# EAGLE schematic boardV1-4 (EAGLE 6.5.0)

## Sheet 1 of 7
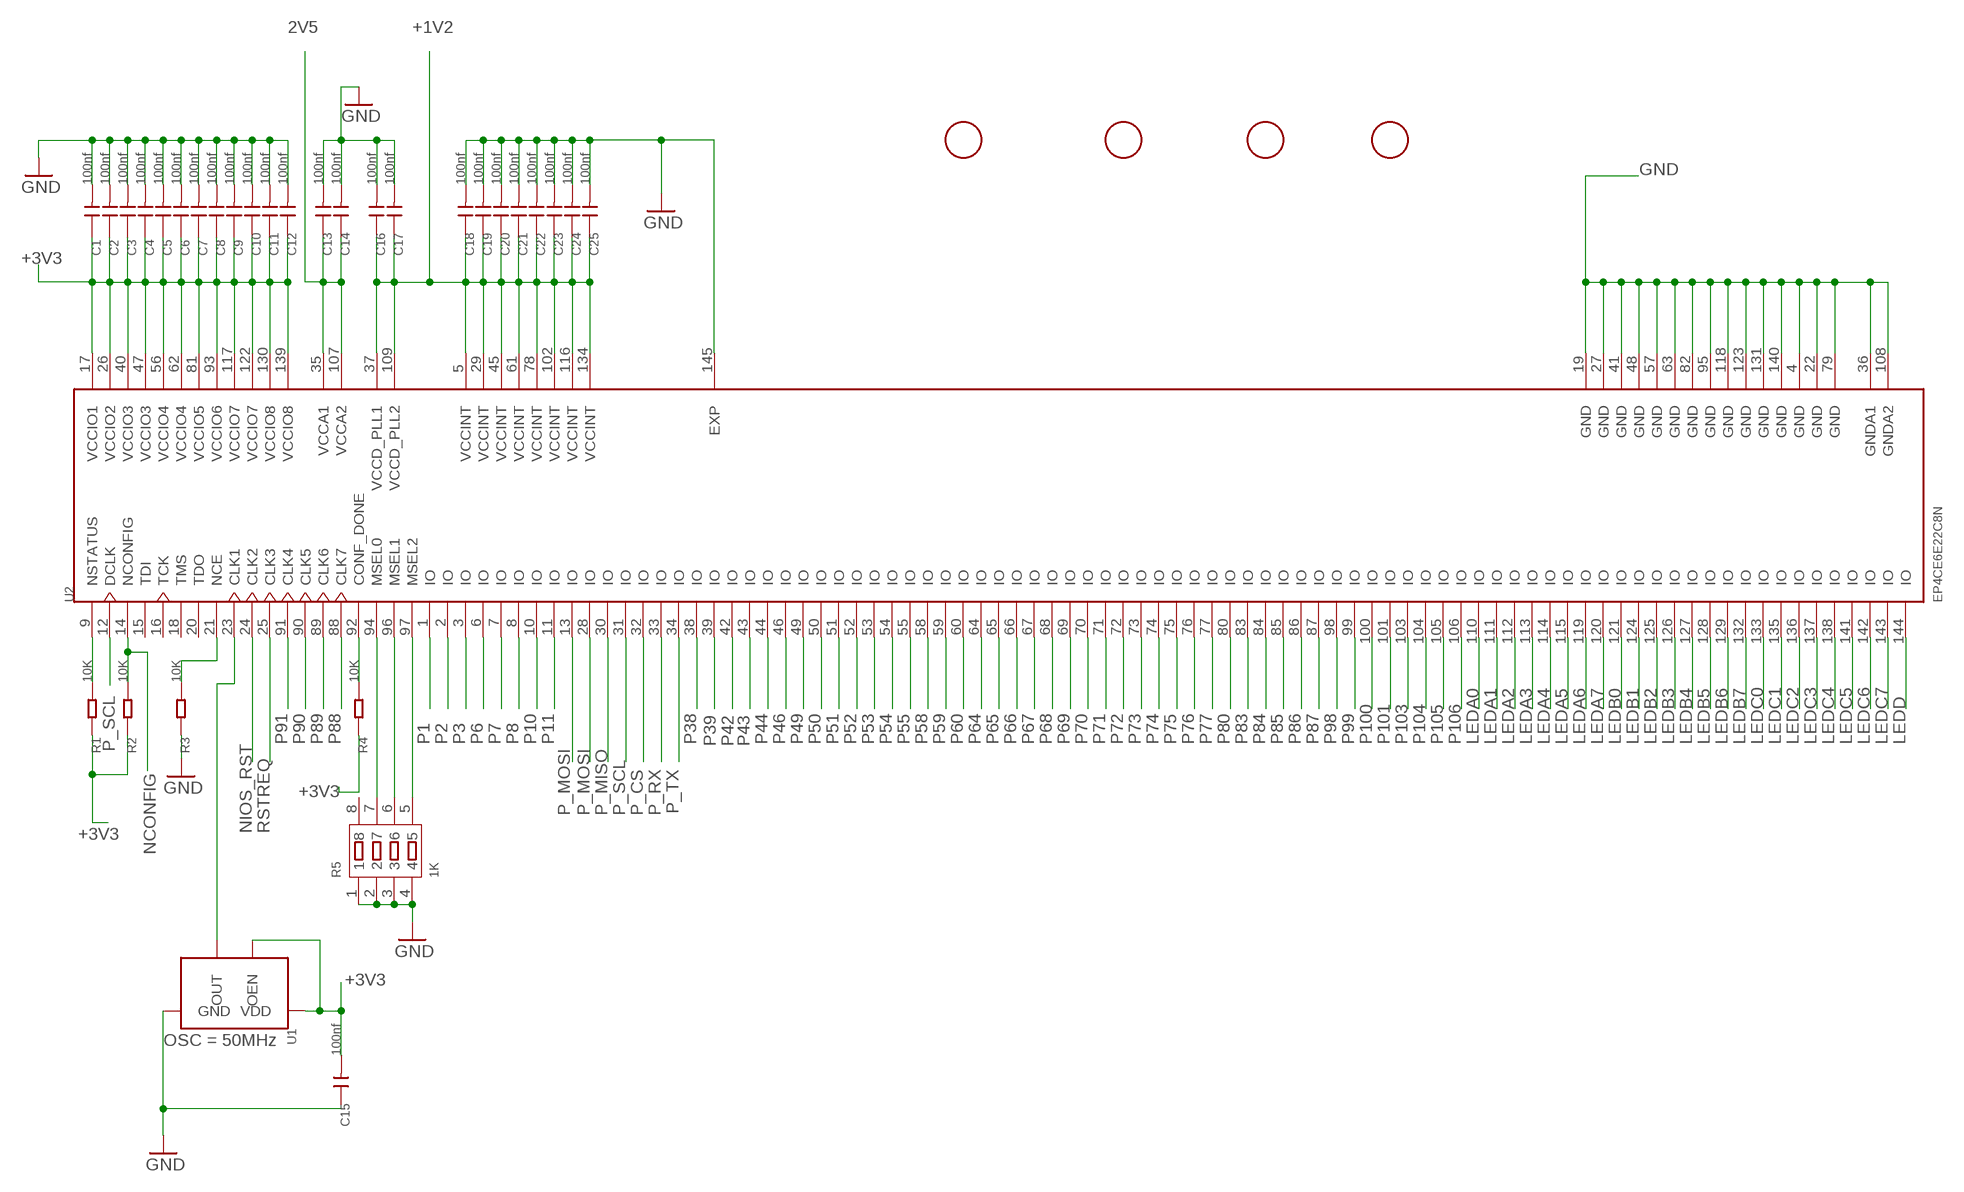
[diagram p0: schematic, sheet 1]

### Parts
C1  100nf  CERAMIC-100NF-50V-10%-X7R(0603)  [C0603]
C2  100nf  CERAMIC-100NF-50V-10%-X7R(0603)  [C0603]
C3  100nf  CERAMIC-100NF-50V-10%-X7R(0603)  [C0603]
C4  100nf  CERAMIC-100NF-50V-10%-X7R(0603)  [C0603]
C5  100nf  CERAMIC-100NF-50V-10%-X7R(0603)  [C0603]
C6  100nf  CERAMIC-100NF-50V-10%-X7R(0603)  [C0603]
C7  100nf  CERAMIC-100NF-50V-10%-X7R(0603)  [C0603]
C8  100nf  CERAMIC-100NF-50V-10%-X7R(0603)  [C0603]
C9  100nf  CERAMIC-100NF-50V-10%-X7R(0603)  [C0603]
C10  100nf  CERAMIC-100NF-50V-10%-X7R(0603)  [C0603]
C11  100nf  CERAMIC-100NF-50V-10%-X7R(0603)  [C0603]
C12  100nf  CERAMIC-100NF-50V-10%-X7R(0603)  [C0603]
C13  100nf  CERAMIC-100NF-50V-10%-X7R(0603)  [C0603]
C14  100nf  CERAMIC-100NF-50V-10%-X7R(0603)  [C0603]
C15  100nf  CERAMIC-100NF-50V-10%-X7R(0603)  [C0603]
C16  100nf  CERAMIC-100NF-50V-10%-X7R(0603)  [C0603]
C17  100nf  CERAMIC-100NF-50V-10%-X7R(0603)  [C0603]
C18  100nf  CERAMIC-100NF-50V-10%-X7R(0603)  [C0603]
C19  100nf  CERAMIC-100NF-50V-10%-X7R(0603)  [C0603]
C20  100nf  CERAMIC-100NF-50V-10%-X7R(0603)  [C0603]
C21  100nf  CERAMIC-100NF-50V-10%-X7R(0603)  [C0603]
C22  100nf  CERAMIC-100NF-50V-10%-X7R(0603)  [C0603]
C23  100nf  CERAMIC-100NF-50V-10%-X7R(0603)  [C0603]
C24  100nf  CERAMIC-100NF-50V-10%-X7R(0603)  [C0603]
C25  100nf  CERAMIC-100NF-50V-10%-X7R(0603)  [C0603]
R1  10K  SMD-RES-10K-1%-1/10W(0603)  [R0603]
R2  10K  SMD-RES-10K-1%-1/10W(0603)  [R0603]
R3  10K  SMD-RES-10K-1%-1/10W(0603)  [R0603]
R4  10K  SMD-RES-10K-1%-1/10W(0603)  [R0603]
R5  1K  SMD-RES-ARRAY-1K-4R(RA1206-8)  [RA1206-8]
U1  306020041_OSC_32.768KHZ-3225_4P  [X3225_4P]
U2  EP4CE6E22C8N  [QFP50P2200X2200X165-145N]
U$1  FIDUCIAL  [FIDUCIAL_1MM]
U$2  FIDUCIAL  [FIDUCIAL_1MM]
U$3  FIDUCIAL  [FIDUCIAL_1MM]
U$4  FIDUCIAL  [FIDUCIAL_1MM]

### Nets
2V5: C13.1 C14.1 U2.35(VCCA1) U2.107(VCCA2) ; also sheet 4
+1V2: C16.1 C17.1 C18.1 C19.1 C20.1 C21.1 C22.1 C23.1 C24.1 C25.1 U2.5(VCCINT) U2.29(VCCINT) U2.37(VCCD_PLL1) U2.45(VCCINT) U2.61(VCCINT) U2.78(VCCINT) U2.102(VCCINT) U2.109(VCCD_PLL2) U2.116(VCCINT) U2.134(VCCINT) ; also sheet 4
+3V3: C1.1 C2.1 C3.1 C4.1 C5.1 C6.1 C7.1 C8.1 C9.1 C10.1 C11.1 C12.1 C15.2 R1.1 R2.1 R4.1 U1.P$1(OEN) U1.P$4(VDD) U2.17(VCCIO1) U2.26(VCCIO2) U2.40(VCCIO3) U2.47(VCCIO3) U2.56(VCCIO4) U2.62(VCCIO4) U2.81(VCCIO5) U2.93(VCCIO6) U2.117(VCCIO7) U2.122(VCCIO7) U2.130(VCCIO8) U2.139(VCCIO8) ; also sheet 2,3,4,6,7
GND: C1.2 C2.2 C3.2 C4.2 C5.2 C6.2 C7.2 C8.2 C9.2 C10.2 C11.2 C12.2 C13.2 C14.2 C15.1 C16.2 C17.2 C18.2 C19.2 C20.2 C21.2 C22.2 C23.2 C24.2 C25.2 R3.1 R5.1 R5.2 R5.3 R5.4 U1.P$2(GND) U2.4(GND) U2.19(GND) U2.22(GND) U2.27(GND) U2.36(GNDA1) U2.41(GND) U2.48(GND) U2.57(GND) U2.63(GND) U2.79(GND) U2.82(GND) U2.95(GND) U2.108(GNDA2) U2.118(GND) U2.123(GND) U2.131(GND) U2.140(GND) U2.145(EXP) ; also sheet 2,3,4,5,6,7
LEDA0: U2.110(IO) ; also sheet 5
LEDA1: U2.111(IO) ; also sheet 5
LEDA2: U2.112(IO) ; also sheet 5
LEDA3: U2.113(IO) ; also sheet 5
LEDA4: U2.114(IO) ; also sheet 5
LEDA5: U2.115(IO) ; also sheet 5
LEDA6: U2.119(IO) ; also sheet 5
LEDA7: U2.120(IO) ; also sheet 5
LEDB0: U2.121(IO) ; also sheet 5
LEDB1: U2.124(IO) ; also sheet 5
LEDB2: U2.125(IO) ; also sheet 5
LEDB3: U2.126(IO) ; also sheet 5
LEDB4: U2.127(IO) ; also sheet 5
LEDB5: U2.128(IO) ; also sheet 5
LEDB6: U2.129(IO) ; also sheet 5
LEDB7: U2.132(IO) ; also sheet 5
LEDC0: U2.133(IO) ; also sheet 5
LEDC1: U2.135(IO) ; also sheet 5
LEDC2: U2.136(IO) ; also sheet 5
LEDC3: U2.137(IO) ; also sheet 5
LEDC4: U2.138(IO) ; also sheet 5
LEDC5: U2.141(IO) ; also sheet 5
LEDC6: U2.142(IO) ; also sheet 5
LEDC7: U2.143(IO) ; also sheet 5
LEDD: U2.144(IO) ; also sheet 5
N$1: R4.2 U2.92(CONF_DONE)
N$2: U1.P$3(OUT) U2.23(CLK1)
N$3: R5.5 U2.97(MSEL2)
N$4: R5.6 U2.96(MSEL1)
N$5: R5.7 U2.94(MSEL0)
N$6: R3.2 U2.21(NCE)
N$8: R1.2 U2.9(NSTATUS)
NCONFIG: R2.2 U2.14(NCONFIG) ; also sheet 6
NIOS_RST: U2.24(CLK2) ; also sheet 6
P1: U2.1(IO) ; also sheet 6
P2: U2.2(IO) ; also sheet 6
P3: U2.3(IO) ; also sheet 6
P6: U2.6(IO) ; also sheet 6
P7: U2.7(IO) ; also sheet 6
P8: U2.8(IO) ; also sheet 6
P10: U2.10(IO) ; also sheet 6
P11: U2.11(IO) ; also sheet 6
P38: U2.38(IO) ; also sheet 6
P39: U2.39(IO) ; also sheet 6
P42: U2.42(IO) ; also sheet 6
P43: U2.43(IO) ; also sheet 6
P44: U2.44(IO) ; also sheet 6
P46: U2.46(IO) ; also sheet 6
P49: U2.49(IO) ; also sheet 6
P50: U2.50(IO) ; also sheet 6
P51: U2.51(IO) ; also sheet 6
P52: U2.52(IO) ; also sheet 6
P53: U2.53(IO) ; also sheet 6
P54: U2.54(IO) ; also sheet 6
P55: U2.55(IO) ; also sheet 6
P58: U2.58(IO) ; also sheet 6
P59: U2.59(IO) ; also sheet 6
P60: U2.60(IO) ; also sheet 6
P64: U2.64(IO) ; also sheet 6
P65: U2.65(IO) ; also sheet 6
P66: U2.66(IO) ; also sheet 6
P67: U2.67(IO) ; also sheet 6
P68: U2.68(IO) ; also sheet 6
P69: U2.69(IO) ; also sheet 6
P70: U2.70(IO) ; also sheet 6
P71: U2.71(IO) ; also sheet 6
P72: U2.72(IO) ; also sheet 6
P73: U2.73(IO) ; also sheet 6
P74: U2.74(IO) ; also sheet 6
P75: U2.75(IO) ; also sheet 6
P76: U2.76(IO) ; also sheet 6
P77: U2.77(IO) ; also sheet 6
P80: U2.80(IO) ; also sheet 6
P83: U2.83(IO) ; also sheet 6
P84: U2.84(IO) ; also sheet 6
P85: U2.85(IO) ; also sheet 6
P86: U2.86(IO) ; also sheet 6
P87: U2.87(IO) ; also sheet 6
P88: U2.88(CLK7) ; also sheet 6
P89: U2.89(CLK6) ; also sheet 6
P90: U2.90(CLK5) ; also sheet 6
P91: U2.91(CLK4) ; also sheet 6
P98: U2.98(IO) ; also sheet 6
P99: U2.99(IO) ; also sheet 6
P100: U2.100(IO) ; also sheet 6
P101: U2.101(IO) ; also sheet 6
P103: U2.103(IO) ; also sheet 6
P104: U2.104(IO) ; also sheet 6
P105: U2.105(IO) ; also sheet 6
P106: U2.106(IO)
P_CS: U2.32(IO) ; also sheet 6
P_MISO: U2.30(IO) ; also sheet 6
P_MOSI: U2.13(IO) U2.28(IO) ; also sheet 6
P_RX: U2.33(IO) ; also sheet 6
P_SCL: U2.12(DCLK) U2.31(IO) ; also sheet 6
P_TX: U2.34(IO) ; also sheet 6
RSTREQ: U2.25(CLK3) ; also sheet 6
Unconnected: R5.8 U2.15(TDI) U2.16(TCK) U2.18(TMS) U2.20(TDO)

## Sheet 2 of 7
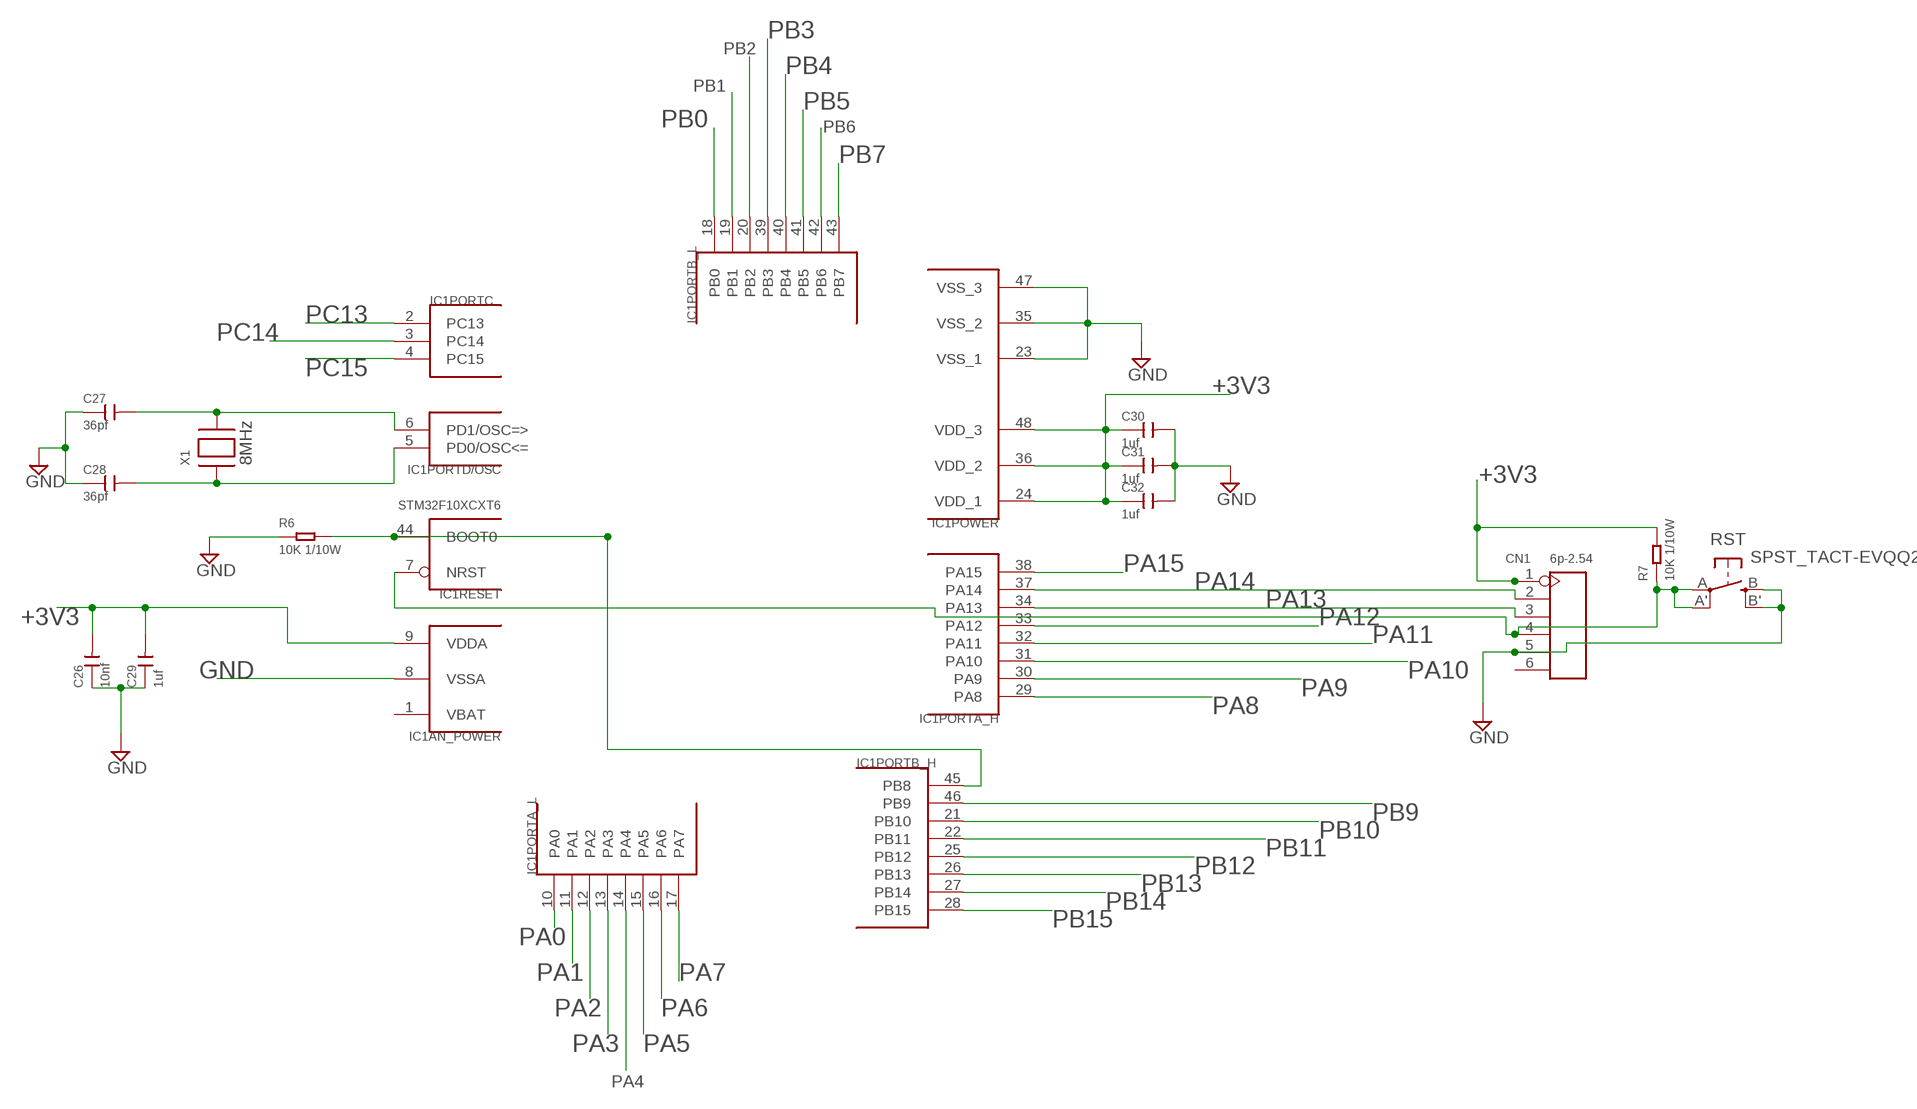
[diagram p1: schematic, sheet 2]

### Parts
C26  10nf  CERAMIC-10NF-50V-10%-X7R(0603)  [C0603]
C27  36pf  CERAMIC-12PF-50V-5%-NPO(0603)  [C0603]
C28  36pf  CERAMIC-12PF-50V-5%-NPO(0603)  [C0603]
C29  1uf  CERAMIC-1UF-25V-10%-X7R(0603)  [C0603]
C30  1uf  CERAMIC-1UF-25V-10%-X7R(0603)  [C0603]
C31  1uf  CERAMIC-1UF-25V-10%-X7R(0603)  [C0603]
C32  1uf  CERAMIC-1UF-25V-10%-X7R(0603)  [C0603]
CN1  6p-2.54  DIP-BLACK-FEMALE-HEADER-VERT(6P-2.54)  [H6-2.54]
IC1  STM32F10XCXT6  [TQFP48]
R6  10K 1/10W  SMD-RES-10K-5%-1/10W(0603)  [R0603]
R7  10K 1/10W  SMD-RES-10K-5%-1/10W(0603)  [R0603]
RST  SPST_TACT-EVQQ2  [EVQ-Q2]
X1  306010047_XTAL_12MHZ-5032_2P  [X5032_2P]

### Nets
+3V3: C26.2 C29.2 C30.1 C31.1 C32.1 CN1.1 IC1.9(AN_POWER:VDDA) IC1.24(POWER:VDD_1) IC1.36(POWER:VDD_2) IC1.48(POWER:VDD_3) R7.2 ; also sheet 1,3,4,6,7
GND: C26.1 C27.1 C28.1 C29.1 C30.2 C31.2 C32.2 CN1.5 IC1.8(AN_POWER:VSSA) IC1.23(POWER:VSS_1) IC1.35(POWER:VSS_2) IC1.47(POWER:VSS_3) R6.1 RST.B'(S1) RST.B(S) ; also sheet 1,3,4,5,6,7
N$9: IC1.44(RESET:BOOT0) IC1.45(PORTB_H:PB8) R6.2
N$10: CN1.4 IC1.7(RESET:NRST) R7.1 RST.A'(P1) RST.A(P)
N$23: C27.2 IC1.6(PORTD/OSC:PD1/OSC=>) X1.P$2
N$24: C28.2 IC1.5(PORTD/OSC:PD0/OSC<=) X1.P$1
PA0: IC1.10(PORTA_L:PA0) ; also sheet 6
PA1: IC1.11(PORTA_L:PA1) ; also sheet 6
PA2: IC1.12(PORTA_L:PA2) ; also sheet 6
PA3: IC1.13(PORTA_L:PA3) ; also sheet 6
PA4: IC1.14(PORTA_L:PA4) ; also sheet 6
PA5: IC1.15(PORTA_L:PA5) ; also sheet 6
PA6: IC1.16(PORTA_L:PA6) ; also sheet 6
PA7: IC1.17(PORTA_L:PA7) ; also sheet 6
PA8: IC1.29(PORTA_H:PA8) ; also sheet 6
PA9: IC1.30(PORTA_H:PA9) ; also sheet 6
PA10: IC1.31(PORTA_H:PA10) ; also sheet 6
PA11: IC1.32(PORTA_H:PA11) ; also sheet 3,6
PA12: IC1.33(PORTA_H:PA12) ; also sheet 3,6
PA13: CN1.3 IC1.34(PORTA_H:PA13) ; also sheet 6,7
PA14: CN1.2 IC1.37(PORTA_H:PA14) ; also sheet 6,7
PA15: IC1.38(PORTA_H:PA15) ; also sheet 6
PB0: IC1.18(PORTB_L:PB0) ; also sheet 6
PB1: IC1.19(PORTB_L:PB1) ; also sheet 5
PB2: IC1.20(PORTB_L:PB2) ; also sheet 6
PB3: IC1.39(PORTB_L:PB3) ; also sheet 6
PB4: IC1.40(PORTB_L:PB4) ; also sheet 6
PB5: IC1.41(PORTB_L:PB5) ; also sheet 6
PB6: IC1.42(PORTB_L:PB6) ; also sheet 6
PB7: IC1.43(PORTB_L:PB7) ; also sheet 6
PB9: IC1.46(PORTB_H:PB9) ; also sheet 3
PB10: IC1.21(PORTB_H:PB10) ; also sheet 6
PB11: IC1.22(PORTB_H:PB11) ; also sheet 6
PB12: IC1.25(PORTB_H:PB12) ; also sheet 6
PB13: IC1.26(PORTB_H:PB13) ; also sheet 6,7
PB14: IC1.27(PORTB_H:PB14) ; also sheet 6,7
PB15: IC1.28(PORTB_H:PB15) ; also sheet 6,7
PC13: IC1.2(PORTC:PC13) ; also sheet 6
PC14: IC1.3(PORTC:PC14) ; also sheet 6
PC15: IC1.4(PORTC:PC15) ; also sheet 6
Unconnected: CN1.6

## Sheet 3 of 7
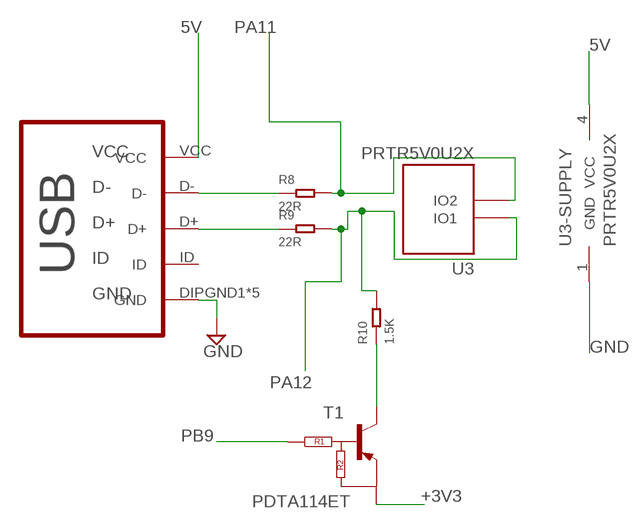
[diagram p2: schematic, sheet 3]

### Parts
R8  22R  SMD-RES-22R-5%-1/10W(0603)  [R0603]
R9  22R  SMD-RES-22R-5%-1/10W(0603)  [R0603]
R10  1.5K  SMD-RES-1.5K-1%-1/10W(0603)  [R0603]
T1  PDTA114ET  [SOT23]
U3  PRTR5V0U2X  [SOT-143B]
USB  MICRO-USB-B  [MICRO_USB_4_LEGS]

### Nets
5V: U3.4(VCC) USB.VCC ; also sheet 4
+3V3: T1.2(E) ; also sheet 1,2,4,6,7
GND: U3.1(GND) USB.DIPGND1(GND) USB.DIPGND2(GND) USB.DIPGND3(GND) USB.DIPGND4(GND) USB.GND ; also sheet 1,2,4,5,6,7
N$7: R8.1 USB.D-
N$11: R9.1 USB.D+
N$12: R10.1 T1.3(C)
PA11: R8.2 U3.3(IO2) ; also sheet 2,6
PA12: R9.2 R10.2 U3.2(IO1) ; also sheet 2,6
PB9: T1.1(INPUT) ; also sheet 2
Unconnected: USB.ID

## Sheet 4 of 7
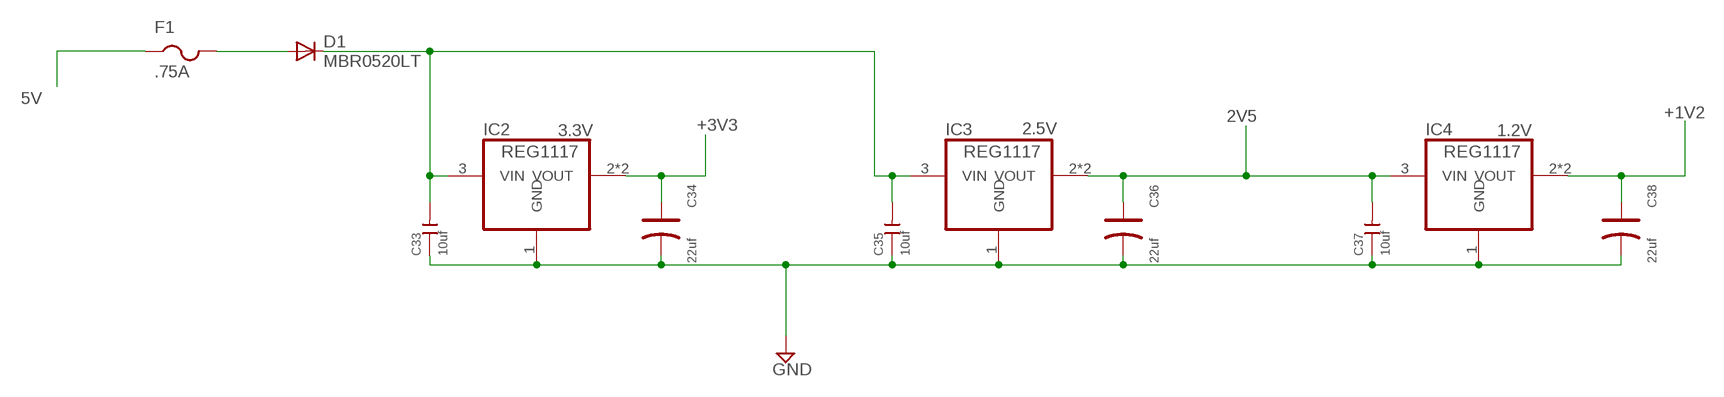
[diagram p3: schematic, sheet 4]

### Parts
C33  10uf  CERAMIC-10UF-25V-10%-X5R(0805)  [C0805]
C34  22uf  TANTALUM-SMD-22UF-6.3V(AVX-A)  [AVX-A]
C35  10uf  CERAMIC-10UF-25V-10%-X5R(0805)  [C0805]
C36  22uf  TANTALUM-SMD-22UF-6.3V(AVX-A)  [AVX-A]
C37  10uf  CERAMIC-10UF-25V-10%-X5R(0805)  [C0805]
C38  22uf  TANTALUM-SMD-22UF-6.3V(AVX-A)  [AVX-A]
D1  MBR0520LT  [SOD123]
F1  .75A  PTCFUSE-1206  [R1206]
IC2  REG1117  [SOT223]
IC3  REG1117  [SOT223]
IC4  REG1117  [SOT223]

### Nets
2V5: C36.+ C37.2 IC3.2(VOUT) IC3.4(VOUT) IC4.3(VIN) ; also sheet 1
5V: F1.1 ; also sheet 3
+1V2: C38.+ IC4.2(VOUT) IC4.4(VOUT) ; also sheet 1
+3V3: C34.+ IC2.2(VOUT) IC2.4(VOUT) ; also sheet 1,2,3,6,7
GND: C33.1 C34.- C35.1 C36.- C37.1 C38.- IC2.1(GND) IC3.1(GND) IC4.1(GND) ; also sheet 1,2,3,5,6,7
N$13: C33.2 C35.2 D1.C IC2.3(VIN) IC3.3(VIN)
N$14: D1.A F1.2

## Sheet 5 of 7
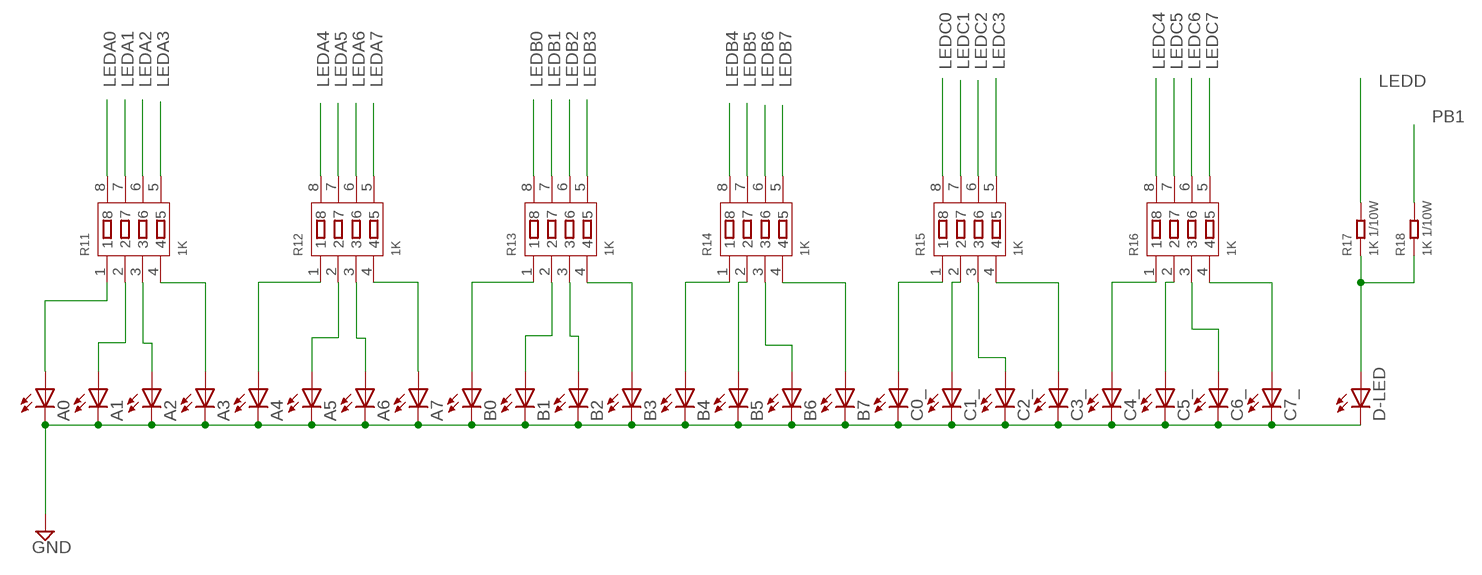
[diagram p4: schematic, sheet 5]

### Parts
A0  LEDCHIPLED_0603  [CHIPLED_0603]
A1  LEDCHIPLED_0603  [CHIPLED_0603]
A2  LEDCHIPLED_0603  [CHIPLED_0603]
A3  LEDCHIPLED_0603  [CHIPLED_0603]
A4  LEDCHIPLED_0603  [CHIPLED_0603]
A5  LEDCHIPLED_0603  [CHIPLED_0603]
A6  LEDCHIPLED_0603  [CHIPLED_0603]
A7  LEDCHIPLED_0603  [CHIPLED_0603]
B0  LEDCHIPLED_0603  [CHIPLED_0603]
B1  LEDCHIPLED_0603  [CHIPLED_0603]
B2  LEDCHIPLED_0603  [CHIPLED_0603]
B3  LEDCHIPLED_0603  [CHIPLED_0603]
B4  LEDCHIPLED_0603  [CHIPLED_0603]
B5  LEDCHIPLED_0603  [CHIPLED_0603]
B6  LEDCHIPLED_0603  [CHIPLED_0603]
B7  LEDCHIPLED_0603  [CHIPLED_0603]
C0_  LEDCHIPLED_0603  [CHIPLED_0603]
C1_  LEDCHIPLED_0603  [CHIPLED_0603]
C2_  LEDCHIPLED_0603  [CHIPLED_0603]
C3_  LEDCHIPLED_0603  [CHIPLED_0603]
C4_  LEDCHIPLED_0603  [CHIPLED_0603]
C5_  LEDCHIPLED_0603  [CHIPLED_0603]
C6_  LEDCHIPLED_0603  [CHIPLED_0603]
C7_  LEDCHIPLED_0603  [CHIPLED_0603]
D-LED  LEDCHIPLED_0603  [CHIPLED_0603]
R11  1K  SMD-RES-ARRAY-1K-4R(RA1206-8)  [RA1206-8]
R12  1K  SMD-RES-ARRAY-1K-4R(RA1206-8)  [RA1206-8]
R13  1K  SMD-RES-ARRAY-1K-4R(RA1206-8)  [RA1206-8]
R14  1K  SMD-RES-ARRAY-1K-4R(RA1206-8)  [RA1206-8]
R15  1K  SMD-RES-ARRAY-1K-4R(RA1206-8)  [RA1206-8]
R16  1K  SMD-RES-ARRAY-1K-4R(RA1206-8)  [RA1206-8]
R17  1K 1/10W  SMD-RES-1K-5%-1/10W(0603)  [R0603]
R18  1K 1/10W  SMD-RES-1K-5%-1/10W(0603)  [R0603]

### Nets
GND: A0.C A1.C A2.C A3.C A4.C A5.C A6.C A7.C B0.C B1.C B2.C B3.C B4.C B5.C B6.C B7.C C0_.C C1_.C C2_.C C3_.C C4_.C C5_.C C6_.C C7_.C D-LED.C ; also sheet 1,2,3,4,6,7
LEDA0: R11.8 ; also sheet 1
LEDA1: R11.7 ; also sheet 1
LEDA2: R11.6 ; also sheet 1
LEDA3: R11.5 ; also sheet 1
LEDA4: R12.8 ; also sheet 1
LEDA5: R12.7 ; also sheet 1
LEDA6: R12.6 ; also sheet 1
LEDA7: R12.5 ; also sheet 1
LEDB0: R13.8 ; also sheet 1
LEDB1: R13.7 ; also sheet 1
LEDB2: R13.6 ; also sheet 1
LEDB3: R13.5 ; also sheet 1
LEDB4: R14.8 ; also sheet 1
LEDB5: R14.7 ; also sheet 1
LEDB6: R14.6 ; also sheet 1
LEDB7: R14.5 ; also sheet 1
LEDC0: R15.8 ; also sheet 1
LEDC1: R15.7 ; also sheet 1
LEDC2: R15.6 ; also sheet 1
LEDC3: R15.5 ; also sheet 1
LEDC4: R16.8 ; also sheet 1
LEDC5: R16.7 ; also sheet 1
LEDC6: R16.6 ; also sheet 1
LEDC7: R16.5 ; also sheet 1
LEDD: R17.2 ; also sheet 1
N$15: A7.A R12.4
N$16: A0.A R11.1
N$17: A1.A R11.2
N$18: A2.A R11.3
N$19: A3.A R11.4
N$20: A4.A R12.1
N$21: A5.A R12.2
N$22: A6.A R12.3
N$25: B0.A R13.1
N$26: B1.A R13.2
N$27: B2.A R13.3
N$28: B3.A R13.4
N$29: B4.A R14.1
N$30: B5.A R14.2
N$31: B6.A R14.3
N$32: B7.A R14.4
N$33: C0_.A R15.1
N$34: C1_.A R15.2
N$35: C2_.A R15.3
N$36: C3_.A R15.4
N$37: C4_.A R16.1
N$38: C5_.A R16.2
N$39: C6_.A R16.3
N$40: C7_.A R16.4
N$41: D-LED.A R17.1 R18.1
PB1: R18.2 ; also sheet 2

## Sheet 6 of 7
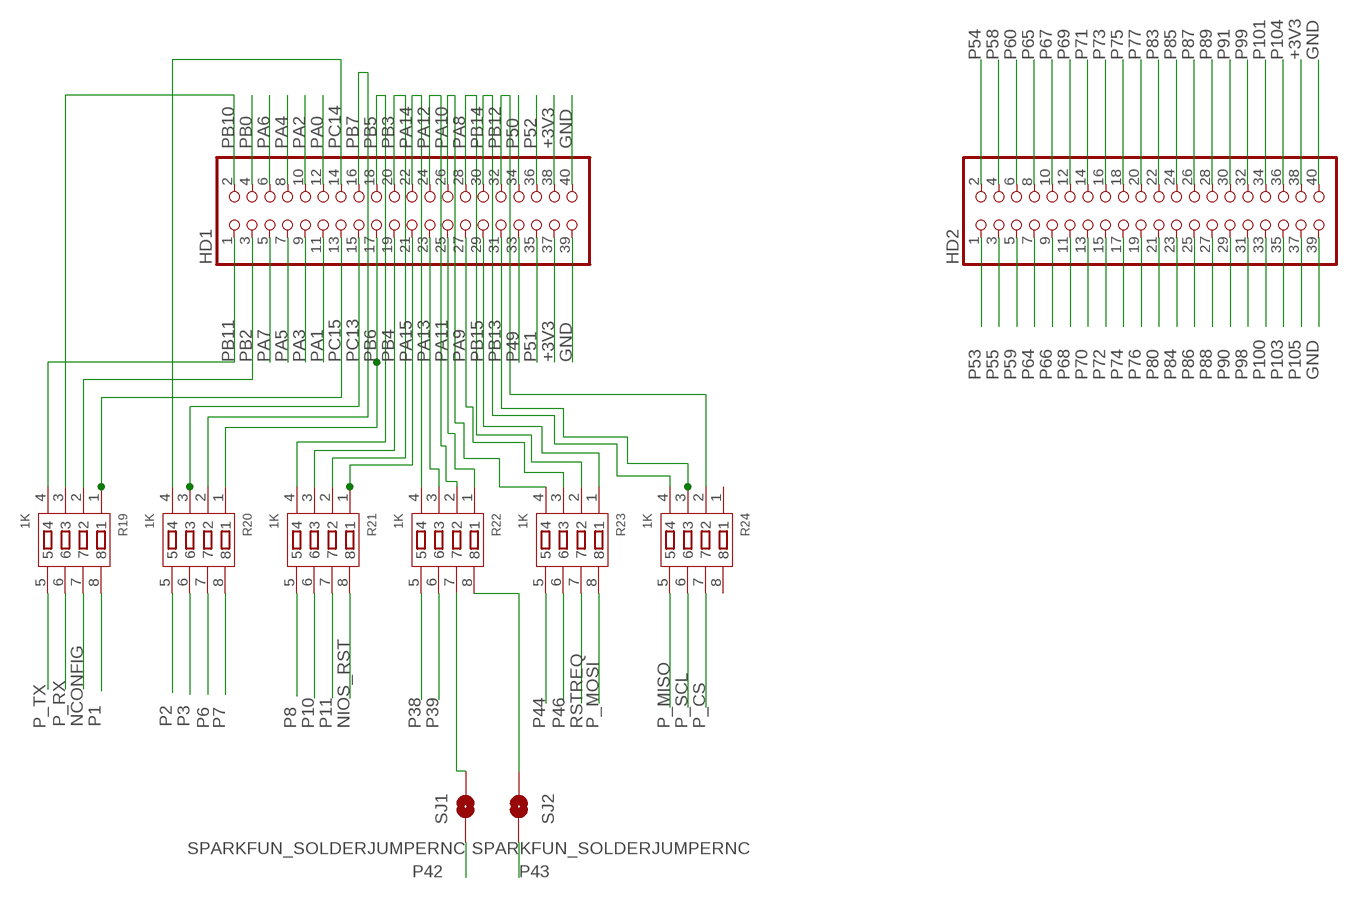
[diagram p5: schematic, sheet 6]

### Parts
HD1  PINHD-2X20  [2X20]
HD2  PINHD-2X20  [2X20]
R19  1K  SMD-RES-ARRAY-1K-4R(RA1206-8)  [RA1206-8]
R20  1K  SMD-RES-ARRAY-1K-4R(RA1206-8)  [RA1206-8]
R21  1K  SMD-RES-ARRAY-1K-4R(RA1206-8)  [RA1206-8]
R22  1K  SMD-RES-ARRAY-1K-4R(RA1206-8)  [RA1206-8]
R23  1K  SMD-RES-ARRAY-1K-4R(RA1206-8)  [RA1206-8]
R24  1K  SMD-RES-ARRAY-1K-4R(RA1206-8)  [RA1206-8]
SJ1  SPARKFUN_SOLDERJUMPERNC  [SPARKFUN_SJ_2S]
SJ2  SPARKFUN_SOLDERJUMPERNC  [SPARKFUN_SJ_2S]

### Nets
+3V3: HD1.37 HD1.38 HD2.38 ; also sheet 1,2,3,4,7
GND: HD1.39 HD1.40 HD2.39 HD2.40 ; also sheet 1,2,3,4,5,7
N$43: R22.7 SJ1.2
N$44: R22.8 SJ2.2
NCONFIG: R19.7 ; also sheet 1
NIOS_RST: R21.8 ; also sheet 1
P1: R19.8 ; also sheet 1
P2: R20.5 ; also sheet 1
P3: R20.6 ; also sheet 1
P6: R20.7 ; also sheet 1
P7: R20.8 ; also sheet 1
P8: R21.5 ; also sheet 1
P10: R21.6 ; also sheet 1
P11: R21.7 ; also sheet 1
P38: R22.5 ; also sheet 1
P39: R22.6 ; also sheet 1
P42: SJ1.1 ; also sheet 1
P43: SJ2.1 ; also sheet 1
P44: R23.5 ; also sheet 1
P46: R23.6 ; also sheet 1
P49: HD1.33 ; also sheet 1
P50: HD1.34 ; also sheet 1
P51: HD1.35 ; also sheet 1
P52: HD1.36 ; also sheet 1
P53: HD2.1 ; also sheet 1
P54: HD2.2 ; also sheet 1
P55: HD2.3 ; also sheet 1
P58: HD2.4 ; also sheet 1
P59: HD2.5 ; also sheet 1
P60: HD2.6 ; also sheet 1
P64: HD2.7 ; also sheet 1
P65: HD2.8 ; also sheet 1
P66: HD2.9 ; also sheet 1
P67: HD2.10 ; also sheet 1
P68: HD2.11 ; also sheet 1
P69: HD2.12 ; also sheet 1
P70: HD2.13 ; also sheet 1
P71: HD2.14 ; also sheet 1
P72: HD2.15 ; also sheet 1
P73: HD2.16 ; also sheet 1
P74: HD2.17 ; also sheet 1
P75: HD2.18 ; also sheet 1
P76: HD2.19 ; also sheet 1
P77: HD2.20 ; also sheet 1
P80: HD2.21 ; also sheet 1
P83: HD2.22 ; also sheet 1
P84: HD2.23 ; also sheet 1
P85: HD2.24 ; also sheet 1
P86: HD2.25 ; also sheet 1
P87: HD2.26 ; also sheet 1
P88: HD2.27 ; also sheet 1
P89: HD2.28 ; also sheet 1
P90: HD2.29 ; also sheet 1
P91: HD2.30 ; also sheet 1
P98: HD2.31 ; also sheet 1
P99: HD2.32 ; also sheet 1
P100: HD2.33 ; also sheet 1
P101: HD2.34 ; also sheet 1
P103: HD2.35 ; also sheet 1
P104: HD2.36 ; also sheet 1
P105: HD2.37 ; also sheet 1
P_CS: R24.7 ; also sheet 1
P_MISO: R24.5 ; also sheet 1
P_MOSI: R23.8 ; also sheet 1
P_RX: R19.6 ; also sheet 1
P_SCL: R24.6 ; also sheet 1
P_TX: R19.5 ; also sheet 1
PA0: HD1.12 ; also sheet 2
PA1: HD1.11 ; also sheet 2
PA2: HD1.10 ; also sheet 2
PA3: HD1.9 ; also sheet 2
PA4: HD1.8 ; also sheet 2
PA5: HD1.7 ; also sheet 2
PA6: HD1.6 ; also sheet 2
PA7: HD1.5 ; also sheet 2
PA8: HD1.28 R23.2 ; also sheet 2
PA9: HD1.27 R23.3 ; also sheet 2
PA10: HD1.26 R23.4 ; also sheet 2
PA11: HD1.25 R22.1 ; also sheet 2,3
PA12: HD1.24 R22.2 ; also sheet 2,3
PA13: HD1.23 R22.3 ; also sheet 2,7
PA14: HD1.22 R22.4 ; also sheet 2,7
PA15: HD1.21 R21.1 ; also sheet 2
PB0: HD1.4 ; also sheet 2
PB2: HD1.3 R19.2 ; also sheet 2
PB3: HD1.20 R21.2 ; also sheet 2
PB4: HD1.19 R21.3 ; also sheet 2
PB5: HD1.18 R21.4 ; also sheet 2
PB6: HD1.17 R20.1 ; also sheet 2
PB7: HD1.16 R20.2 ; also sheet 2
PB10: HD1.2 R19.3 ; also sheet 2
PB11: HD1.1 R19.4 ; also sheet 2
PB12: HD1.32 R24.2 ; also sheet 2
PB13: HD1.31 R24.3 ; also sheet 2,7
PB14: HD1.30 R24.4 ; also sheet 2,7
PB15: HD1.29 R23.1 ; also sheet 2,7
PC13: HD1.15 R20.3 ; also sheet 2
PC14: HD1.14 R20.4 ; also sheet 2
PC15: HD1.13 R19.1 ; also sheet 2
RSTREQ: R23.7 ; also sheet 1
Unconnected: R24.1 R24.8

## Sheet 7 of 7
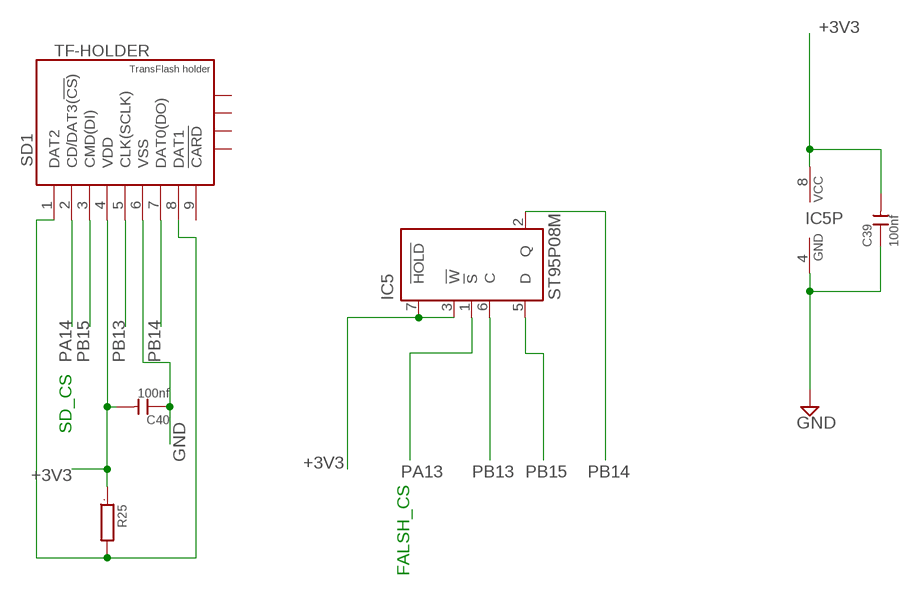
[diagram p6: schematic, sheet 7]

### Parts
C39  100nf  CERAMIC-100NF-50V-10%-X7R(0603)  [C0603]
C40  100nf  CERAMIC-100NF-50V-10%-X7R(0603)  [C0603]
IC5  ST95P08M  [SO08]
R25  R0603  [0603$1]
SD1  TF-HOLDER  [TF-PULL]

### Nets
+3V3: C39.2 C40.2 IC5.3(!W) IC5.7(!HOLD) IC5.8(VCC) R25.1 SD1.4(VDD) ; also sheet 1,2,3,4,6
GND: C39.1 C40.1 IC5.4(GND) SD1.6(VSS) ; also sheet 1,2,3,4,5,6
N$42: R25.2 SD1.1(DAT2) SD1.8(DAT1)
PA13: IC5.1(!S) ; also sheet 2,6
PA14: SD1.2(CD/DAT3(!CS!)) ; also sheet 2,6
PB13: IC5.6(C) SD1.5(CLK(SCLK)) ; also sheet 2,6
PB14: IC5.2(Q) SD1.7(DAT0(DO)) ; also sheet 2,6
PB15: IC5.5(D) SD1.3(CMD(DI)) ; also sheet 2,6
Unconnected: SD1.9(!CARD) SD1.S1 SD1.S2 SD1.S3 SD1.S4

### Notes on the sheet
- SD_CS
- FALSH_CS

## Power pins joined to a net without a drawn wire
VBAT: IC1.1(AN_POWER:VBAT)

## Library data of the parts
A0 A1-A7 B0 B1-B7 C0_ C1_ C2_ C3_ C4_ C5_ C6_ C7_ D-LED = BPC3010_Papilio_Pro:LED: LED OSRAM: - CHIPLED LG R971, LG N971, LY N971, LG Q971, LY Q971, LO R971, LY R971 LH N974, LH R974 LS Q976, LO Q976, LY Q976 LO Q996 - Hyper CHIPLED LW Q18S LB Q993, LB Q99A, LB R99A - SideLED LS A670, LO A670, LY A670, LG A670, LP A670 LB A673, LV A673, LT A673, LW A673 LH A674 LY A675 LS A676, LA A676, LO A676, LY A676, LW A676 LS A679, LY A679, LG A679 - Hyper Micro SIDELED® LS Y876, LA Y876, LO Y876, LY Y876 LT Y87S - SmartLED LW L88C, LW L88S LB L89C, LB L89S, LG L890 LS L89K, LO L89K, LY L89K LS L896, LA L896, LO L896, LY L896 - TOPLED LS T670, LO T670, LY T670, LG T670, LP T670 LSG T670, LSP T670, LSY T670, LOP T670, LYG T670 LG T671, LOG T671, LSG T671 LB T673, LV T673, LT T673, LW T673 LH T674 LS T676, LA T676, LO T676, LY T676, LB T676, LH T676, LSB T676, LW T676 LB T67C, LV T67C, LT T67C, LS T67K, LO T67K, LY T67K, LW E67C LS E67B, LA E67B, LO E67B, LY E67B, LB E67C, LV E67C, LT E67C LW T67C LS T679, LY T679, LG T679 LS T770, LO T770, LY T770, LG T770, LP T770 LB T773, LV T773, LT T773, LW T773 LH T774 LS E675, LA E675, LY E675, LS T675 LS T776, LA T776, LO T776, LY T776, LB T776 LHGB T686 LT T68C, LB T68C - Hyper Mini TOPLED® LB M676 - Mini TOPLED Santana® LG M470 LS M47K, LO M47K, LY M47K Source: http://www.osram.convergy.de LUXEON: - LUMILED® LXK2-PW12-R00, LXK2-PW12-S00, LXK2-PW14-U00, LXK2-PW14-V00 LXK2-PM12-R00, LXK2-PM12-S00, LXK2-PM14-U00 LXK2-PE12-Q00, LXK2-PE12-R00, LXK2-PE12-S00, LXK2-PE14-T00, LXK2-PE14-U00 LXK2-PB12-K00, LXK2-PB12-L00, LXK2-PB12-M00, LXK2-PB14-N00, LXK2-PB14-P00, LXK2-PB14-Q00 LXK2-PR12-L00, LXK2-PR12-M00, LXK2-PR14-Q00, LXK2-PR14-R00 LXK2-PD12-Q00, LXK2-PD12-R00, LXK2-PD12-S00 LXK2-PH12-R00, LXK2-PH12-S00 LXK2-PL12-P00, LXK2-PL12-Q00, LXK2-PL12-R00 Source: www.luxeon.com KINGBRIGHT: KA-3528ASYC Source: www.kingbright.com
C1-C25 = Seeed-OPL-Capacitor:CERAMIC-100NF-50V-10%-X7R(0603): 302010138; MPN: CC0603KRX7R9BB104
C26 = Seeed-Capacitor:CERAMIC-10NF-50V-10%-X7R(0603): 302010140; MPN: CC0603KRX7R9BB103
C27 C28 = Seeed-Capacitor:CERAMIC-12PF-50V-5%-NPO(0603): 302010067; MPN: CC0603JRNPO9BN120; VALUE: 12pf
C29-C32 = Seeed-Capacitor:CERAMIC-1UF-25V-10%-X7R(0603): 302010139; MPN: CC0603KRX7R8BB105
C33 C35 C37 = Seeed-Capacitor:CERAMIC-10UF-25V-10%-X5R(0805): 302010178; MPN: CC0805KKX5R8BB106
C34 C36 C38 = Seeed-OPL-Capacitor:TANTALUM-SMD-22UF-6.3V(AVX-A): 302020009; MPN: TAJA226K006RNJ
C39 C40 = Seeed-Capacitor:CERAMIC-100NF-50V-10%-X7R(0603): 302010138; MPN: CC0603KRX7R9BB104
CN1 = Seeed-Connector:DIP-BLACK-FEMALE-HEADER-VERT(6P-2.54): 320030060; MPN: F185-1106A1BSYC1
D1 = diode:MBR0520LT: SCHOTTKY BARRIER RECTIFIER Source: http://onsemi.com .. MBR0520LT1-D.pdf
F1 = adafruit:PTCFUSE: PTC fuses, resettable thermistors
HD1 HD2 = adafruit:PINHD-2X20: PIN HEADER
IC1 = stm32:STM32F10XCXT6: ST STM32F101/103 48pin LQFP
IC2 = burr-brown:REG1117: 800mA and 1A Low Dropout (LDO) Positive Regulator 1.8V, 2.5V, 2.85V, 3.3V, 5V, and Adj; MPN: REG1117; OC_FARNELL: 1097566; OC_NEWARK: 14P6981; OUT: 3.3V
IC3 = burr-brown:REG1117: 800mA and 1A Low Dropout (LDO) Positive Regulator 1.8V, 2.5V, 2.85V, 3.3V, 5V, and Adj; MPN: REG1117; OC_FARNELL: 1097566; OC_NEWARK: 14P6981; OUT: 2.5V
IC4 = burr-brown:REG1117: 800mA and 1A Low Dropout (LDO) Positive Regulator 1.8V, 2.5V, 2.85V, 3.3V, 5V, and Adj; MPN: REG1117; OC_FARNELL: 1097566; OC_NEWARK: 14P6981; V: 1.2V
IC5 = st-microelectronics:ST95P08M: Serial EEPROM SPI bus, 1 K x 8; OC_FARNELL: unknown; OC_NEWARK: unknown
R1-R4 = Seeed-OPL-Resistor:SMD-RES-10K-1%-1/10W(0603): 301010299; MPN: RC0603FR-0710KL
R5 R11-R16 = Seeed-OPL-Resistor:SMD-RES-ARRAY-1K-4R(RA1206-8): 301030012; MPN: Chip-Array-Series-1%
R6 R7 = Seeed-Resistor:SMD-RES-10K-5%-1/10W(0603): 301010293; MPN: RC0603JR-0710KL
R8 R9 = Seeed-OPL-Resistor:SMD-RES-22R-5%-1/10W(0603): 301010289; MPN: RC0603JR-0722RL
R10 = Seeed-Resistor:SMD-RES-1.5K-1%-1/10W(0603): 301010189; MPN: RC0603FR-071K5L
R17 R18 = Seeed-OPL-Resistor:SMD-RES-1K-5%-1/10W(0603): 301010291; MPN: RC0603JR-071KL
R19-R24 = Seeed-Resistor:SMD-RES-ARRAY-1K-4R(RA1206-8): 301030012; MPN: Chip-Array-Series-1%
R25 = BPC3010_Papilio_Pro:R: RESISTOR, European symbol
RST = adafruit:SPST_TACT: SMT 6mm switch, EVQQ2 series http://www.ladyada.net/library/eagle
SD1 = sd-mmc:TF-HOLDER: TF / Micro SD socket is PUSH-PUSH type, the card can be pushed into and auto locked and pushed out by simply press the card. Surface Mounting type.
SJ1 SJ2 = CANBusTriple_f:SPARKFUN_SOLDERJUMPER: Solder Jumper Standard SMD solder jumper. Used to automate production. Two varients : Normally Open and Normally Closed are the same, but have different paste layers. NC will have a large amount of paste and should jumper during reflow.
T1 = nxp_60:PDTA114: PNP Resistor-Equipped Transistor (RET) family in small Surface-Mounted Device (SMD) plastic packages. AAL Eindhoven MK
U1 = Seeed-OPL-2017-01-Crystal-Akita:306020041_OSC_32.768KHZ-3225_4P: TXC;7XZ-32.768KHz, SMD Oscillator 32.768kHz;4P-L3.2*W2.5*H1.0mm, SKU: 306020041; OSC: 50MHz
U2 = EP4CE6E22C8N:EP4CE6E22C8N: Ic Cyclone Iv Fpga 6k 144eqfp - Ep4ce6e22c8n; AVAILABILITY: Warning; DESCRIPTION: Ic Cyclone Iv Fpga 6k 144eqfp - Ep4ce6e22c8n; MF: Altera; MP: EP4CE6E22C8N; PACKAGE: LQFP-144 Altera; PRICE: 8.53 USD
U3 = Volks73-NXPSemiconductors:PRTR5V0U2X?: I2C-Bus EDS Protection Ulta low capacitance double rail-to-rail ESD protection diode Documentation Datasheet <http://www.nxp.com/documents/data_sheet/PRTR5V0U2X.pdf> General Description Ultra low capacitance rail-to-rail ElectroStatic Discharge (ESD) protection diode in a small SOT143B Surface-Mounted Device (SMD) plastic package designed to protect two Hi-Speed data lines or high-frequency signal lines from the damage caused by ESD and other transients. PRTR5V0U2X incorporates two pairs of ultra low capacitance rail-to-rail diodes as well as an additional ESD protection diode to ensure signal line protection even if no supply voltage is available. Features ESD protection of two Hi-Speed data lines or high-frequency signal lines Ultra low input/output to ground capacitance: C(I/O-GND) = 1 pF ESD protection up to 8kV IEC 61000-4-2, level 4 (ESD) Very low clamping voltage due to an integrated additional ESD protection diode Very low reverse current Small SMD plastic package Applications USB 2.0 ports Digital Video Interface (DVI)/High Definition Multimedia Interface (HDMI) interfaces Mobile and cordless phones Personal Digital Assistants (PDA) Digital Cameras Wide Area Network (WAN) / Local Area Network (LAN) systems PCs, notebooks, printers, and other PC peripherals; APPLICATIONS: General Purpose; BIDIRECTIONAL_CHANNELS: 2; CAPACITANCE: 1pF @ 1MHz; CURRENT_PEAK_PULSE: -; DESCRIPTION: TVS DIODE 5.5VWM SOT143B; DOCUMENTATION_LINK: <a href="http://www.nxp.com/documents/data_sheet/PRTR5V0U2X.pdf">Datasheet</a>; DOCUMENTATION_URL: http://www.nxp.com/documents/data_sheet/PRTR5V0U2X.pdf; MANUFACTURER: NXP Semiconductors; MOUNTING_TYPE: Surface Mount; OPERATING_TEMPERATURE: -40C ~ 85C; PART_NUMBER: PRTR5V0U2X,215; POWER-PEAK_PULSE: -; POWER_LINE_PROTECTION: Yes; SUPPLIER_ITEM_LINK: <a href="http://www.digikey.com/product-detail/en/PRTR5V0U2X,215/568-4140-1-ND/1589981">Details</a>; SUPPLIER_ITEM_NUMBER: 568-4140-1-ND; SUPPLIER_ITEM_URL: http://www.digikey.com/product-detail/en/PRTR5V0U2X,215/568-4140-1-ND/1589981; SUPPLIER_LINK: <a href="http://www.digikey.com">Home Page</a>; SUPPLIER_NAME: Digi-Key; SUPPLIER_URL: http://www.digikey.com; TYPE: Steering (Rail to Rail); UNIDIRECTIONAL_CHANNELS: -; VOLTAGE_BREAKDOWN: 6V; VOLTAGE_CLAMPING: -; VOLTAGE_REVERSE: 5.5V
U$1-U$4 = adafruit:FIDUCIAL: For use by pick and place machines to calibrate the vision/machine, 1mm By microbuilder.eu
USB = micro_usb_B-4LEGS:MICRO-USB-B
X1 = Seeed-OPL-2017-01-Crystal-Akita:306010047_XTAL_12MHZ-5032_2P: SMD Crystal 12MHz-20pF-20ppm-40R;2P-L5.0*W3.2mm, SKU: 306010047; FQ: 8MHz